# EAGLE design Large Digit Driver (EAGLE 7.2.0)
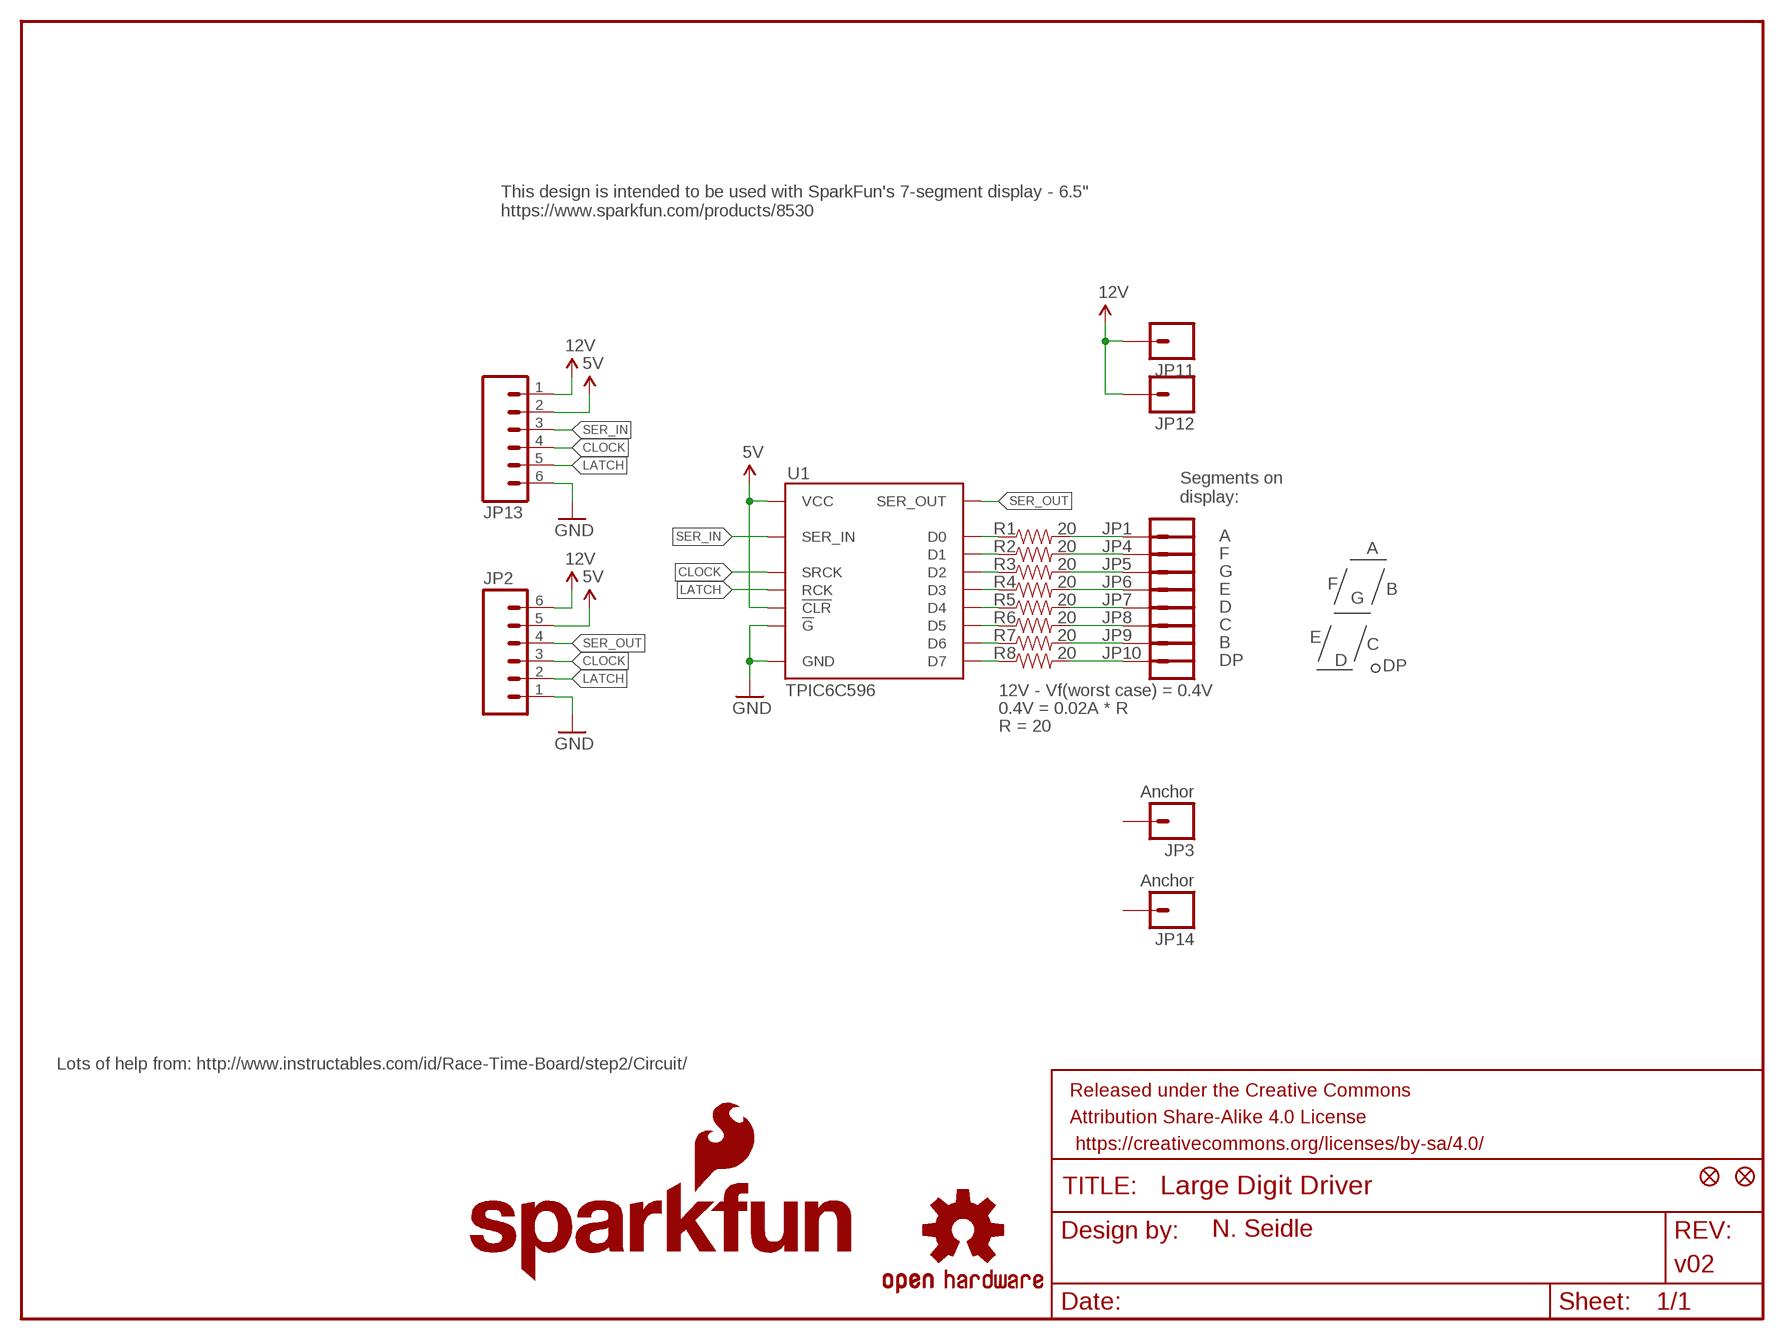
[diagram p0: schematic, sheet 1]

## Parts
FID1  FIDUCIAL1X2  [FIDUCIAL-1X2]
FID2  FIDUCIAL1X2  [FIDUCIAL-1X2]
FRAME1  FRAME-LETTER  [CREATIVE_COMMONS]
JP1  M01PTH_LONGPAD  [1X01_LONGPAD]
JP2  M06SMD  [1X06-SMD]
JP3  Anchor  M01PTH_LONGPAD  [1X01_LONGPAD]
JP4  M01PTH_LONGPAD  [1X01_LONGPAD]
JP5  M01PTH_LONGPAD  [1X01_LONGPAD]
JP6  M01PTH_LONGPAD  [1X01_LONGPAD]
JP7  M01PTH_LONGPAD  [1X01_LONGPAD]
JP8  M01PTH_LONGPAD  [1X01_LONGPAD]
JP9  M01PTH_LONGPAD  [1X01_LONGPAD]
JP10  M01PTH_LONGPAD  [1X01_LONGPAD]
JP11  M01PTH_LONGPAD  [1X01_LONGPAD]
JP12  M01PTH_LONGPAD  [1X01_LONGPAD]
JP13  M06SMD  [1X06-SMD]
JP14  Anchor  M01PTH_LONGPAD  [1X01_LONGPAD]
LOGO1  SFE_LOGO_NAME_FLAME.1_INCH  [SFE_LOGO_NAME_FLAME_.1]
LOGO2  OSHW-LOGOS  [OSHW-LOGO-S]
R1  20  20OHM1/10W1%(0603)SMD  [0603-RES]
R2  20  20OHM1/10W1%(0603)SMD  [0603-RES]
R3  20  20OHM1/10W1%(0603)SMD  [0603-RES]
R4  20  20OHM1/10W1%(0603)SMD  [0603-RES]
R5  20  20OHM1/10W1%(0603)SMD  [0603-RES]
R6  20  20OHM1/10W1%(0603)SMD  [0603-RES]
R7  20  20OHM1/10W1%(0603)SMD  [0603-RES]
R8  20  20OHM1/10W1%(0603)SMD  [0603-RES]
U1  TPIC6C596  TPIC6C596SOIC  [SO016]

## Nets
5V: JP2.5 JP13.2 U1.1(VCC) U1.7(!CLR)
12V: JP2.6 JP11.1 JP12.1 JP13.1
CLOCK: JP2.3 JP13.4 U1.15(SRCK)
D0: R1.1 U1.3(D0)
D1: R2.1 U1.4(D1)
D2: R3.1 U1.5(D2)
D3: R4.1 U1.6(D3)
D4: R5.1 U1.11(D4)
D5: R6.1 U1.12(D5)
D6: R7.1 U1.13(D6)
D7: R8.1 U1.14(D7)
GND: JP2.1 JP13.6 U1.8(!G) U1.16(GND)
LATCH: JP2.2 JP13.5 U1.10(RCK)
S0: JP1.1 R1.2
S1: JP4.1 R2.2
S2: JP5.1 R3.2
S3: JP6.1 R4.2
S4: JP7.1 R5.2
S5: JP8.1 R6.2
S6: JP9.1 R7.2
S7: JP10.1 R8.2
SER_IN: JP13.3 U1.2(SER_IN)
SER_OUT: JP2.4 U1.9(SER_OUT)
Unconnected: JP3.1 JP14.1

## Notes on the sheet
- This design is intended to be used with SparkFun's 7-segment display - 6.5"
  https://www.sparkfun.com/products/8530
- Segments on
  display:
- A
- A
- F
- G
- F
- E | B
- G
- D
- C
- E
- B | C
- DP | D
- DP
- 12V - Vf(worst case) = 0.4V
- 0.4V = 0.02A * R
- R = 20
- Lots of help from: http://www.instructables.com/id/Race-Time-Board/step2/Circuit/

## Library data of the parts
FID1 FID2 = SparkFun-Aesthetics:FIDUCIAL: Fiducial Alignment Points Various fiducial points for machine vision alignment.
FRAME1 = SparkFun-Aesthetics:FRAME-LETTER: Schematic Frame Standard 8.5x11 US Letter frame; DESIGNER: N. Seidle; VERSION: v02
JP1 JP3-JP12 JP14 = SparkFun-Connectors:M01: Header 1 Standard 1-pin 0.1" header. Use with straight break away headers (SKU : PRT-00116), right angle break away headers (PRT-00553), swiss pins (PRT-00743), machine pins (PRT-00117), and female headers (PRT-00115).
JP2 JP13 = SparkFun-Connectors:M06: Header 6 Standard 6-pin 0.1" header. Use with straight break away headers (SKU : PRT-00116), right angle break away headers (PRT-00553), swiss pins (PRT-00743), machine pins (PRT-00117), and female headers (PRT-00115). Molex polarized connector foot print use with SKU : PRT-08094 with associated crimp pins and housings. NOTES ON THE VARIANTS LOCK and LOCK_LONGPADS... This footprint was designed to help hold the alignment of a through-hole component (i.e. 6-pin header) while soldering it into place. You may notice that each hole has been shifted either up or down by 0.005 of an inch from it's more standard position (which is a perfectly straight line). This slight alteration caused the pins (the squares in the middle) to touch the edges of the holes. Because they are alternating, it causes a "brace" to hold the component in place. 0.005 has proven to be the perfect amount of "off-center" position when using our standard breakaway headers. Although looks a little odd when you look at the bare footprint, once you have a header in there, the alteration is very hard to notice. Also,if you push a header all the way into place, it is covered up entirely on the bottom side. This idea of altering the position of holes to aid alignment will be further integrated into the Sparkfun Library for other footprints. It can help hold any component with 3 or more connection pins.; PROD_ID: CONN-08971; VALUE: RA 6Pin SMD
LOGO1 = SparkFun-Aesthetics:SFE_LOGO_NAME_FLAME: SFE Logo, name and flame This is the SparkFun full logo. The logo on the schematic will always be the same size; the package variant is the height of the flame part of the logo. Default layer for the logo on the board is tSilk.
LOGO2 = SparkFun-Aesthetics:OSHW-LOGO: Open Source Hardware Logo This logo indicates the piece of hardware it is found on incorporates a OSHW license and/or adheres to the definition of open source hardware found here: http://freedomdefined.org/OSHW
R1-R8 = SparkFun-Resistors:20OHM1/10W1%(0603): RES-07862; PROD_ID: RES-07862
U1 = SparkFun-DigitalIC:TPIC6C596: SMD version of the popular sink driver. This version can sink up to 100mA per channel; PROD_ID: IC-12522

## Net classes
1 power: width 0.203 mm

## Board
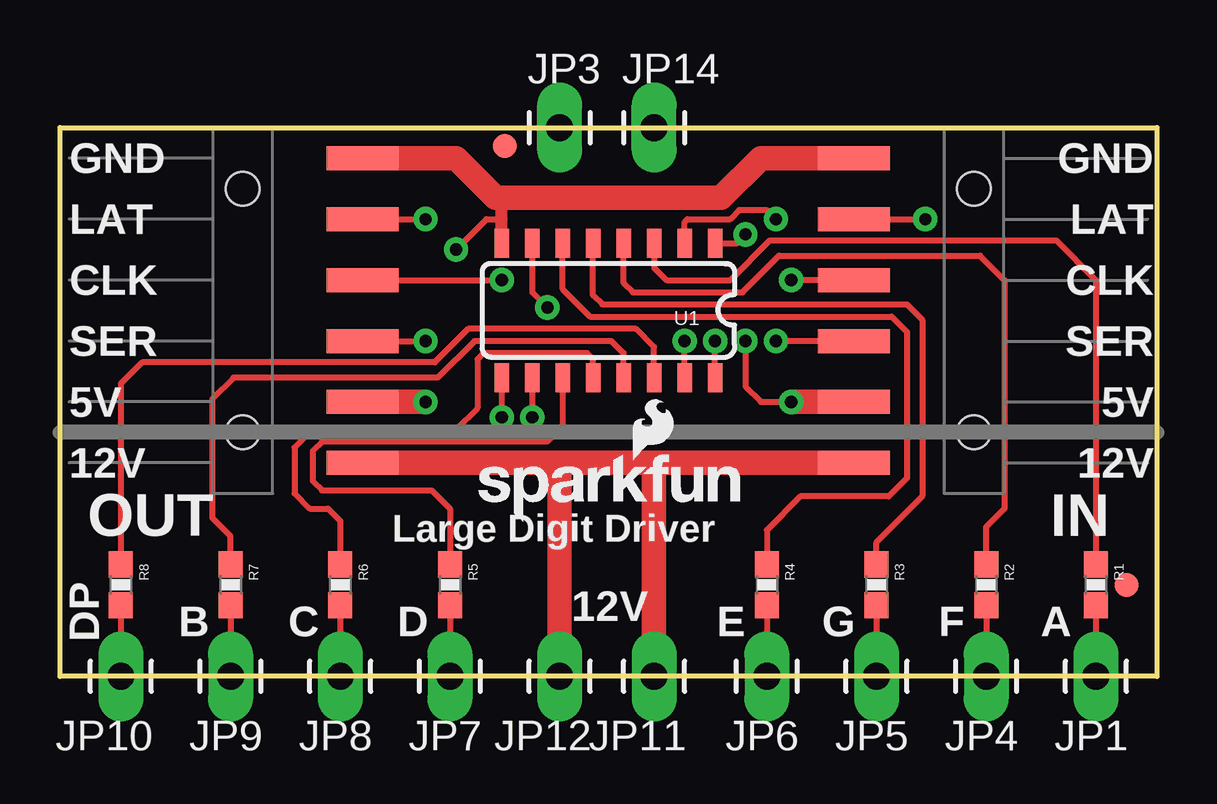
[diagram p1: board, top side]
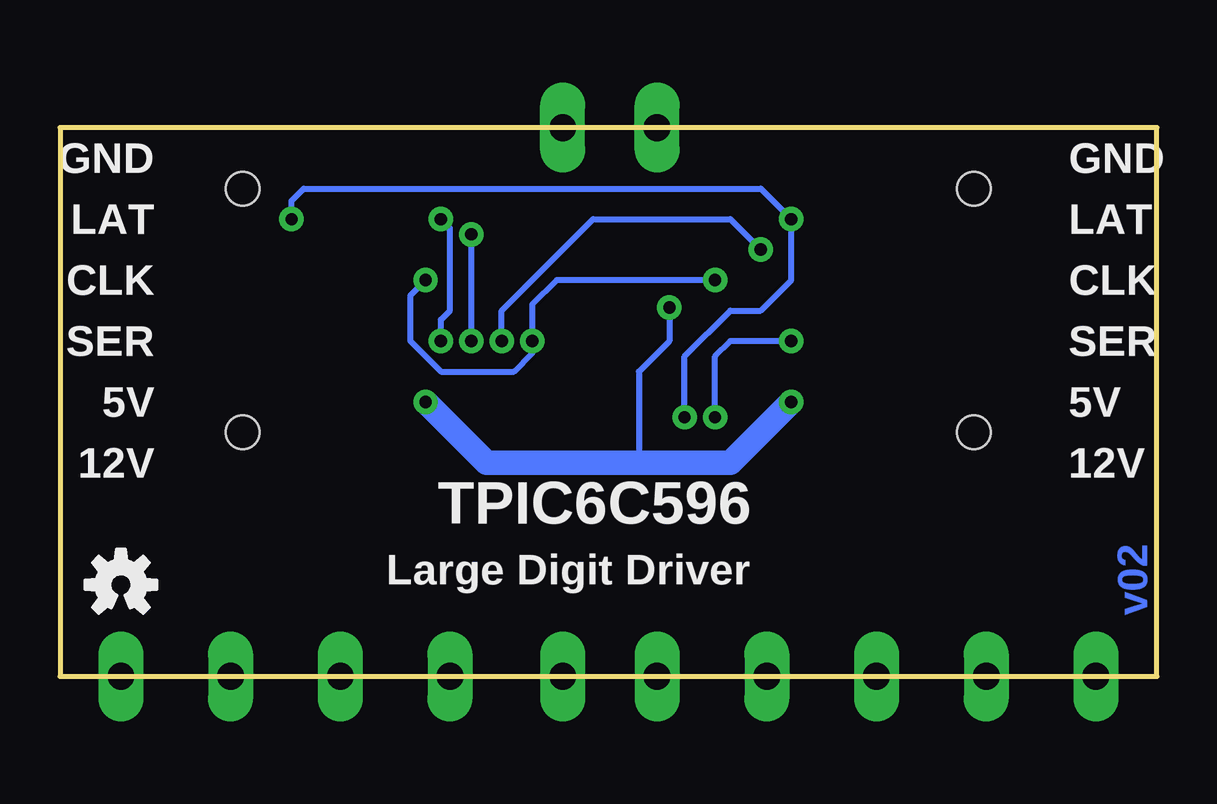
[diagram p2: board, bottom side, seen from below]

Size 45.72 x 22.86 mm. Coordinates in mm from the lower left corner, seen from the top.
Outline: 0,22.86 45.72,22.86 45.72,0 0,0 0,22.86
Copper layers (1*16): Top 0.035mm / dielectric 1.5mm / Bottom 0.035mm
Design rules "SparkFun-2-layer": minimum track width 7mil, minimum drill 15mil, track to track 8mil, track to pad 8mil, pad to pad 8mil, via to via 8mil, smd to smd 8mil, copper to edge 8mil, drill to drill 8mil, minimum pad ring 12mil, minimum via ring 10mil, stop-mask expansion 4mil, vias tented up to drill 20mil, thermal gap 10mil

### Footprints (pad centres in the part's own frame; a part is rotated, then mirrored left to right if it is on the bottom)
FIDUCIAL-1X2 = smd 1 x 1: 1 0,0
1X01_LONGPAD = drill 1.118 pad 1.88 long: 1 0,0
1X06-SMD = smd 1 x 3: 1 -6.35,5; 2 -3.81,5; 3 -1.27,5; 4 1.27,5; 5 3.81,5; 6 6.35,5 | hole 1.4: -5.08,0; 5.08,0
0603-RES = smd 1.1 x 1: 1 -0.85,0; 2 0.85,0
SO016 = smd 0.6 x 1.2: 1 -4.445,-2.8; 2 -3.175,-2.8; 3 -1.905,-2.8; 4 -0.635,-2.8; 5 0.635,-2.8; 6 1.905,-2.8; 7 3.175,-2.8; 8 4.445,-2.8; 9 4.445,2.8; 10 3.175,2.8; 11 1.905,2.8; 12 0.635,2.8; 13 -0.635,2.8; 14 -1.905,2.8; 15 -3.175,2.8; 16 -4.445,2.8

### Placement (x,y rotation side)
FID1  18.54,22.1 0 top
FID2  44.45,3.81 0 top
FRAME1  -6.35,-17.78 0 top  (outside the outline)
JP1  43.18,0 180 top
JP2  7.62,15.24 270 top
JP3  20.83,22.86 0 top
JP4  38.61,0 180 top
JP5  34.04,0 180 top
JP6  29.46,0 180 top
JP7  16.26,0 180 top
JP8  11.68,0 180 top
JP9  7.11,0 180 top
JP10  2.54,0 180 top
JP11  24.77,0 180 top
JP12  20.83,0 180 top
JP13  38.1,15.24 90 top
JP14  24.77,22.86 0 top
LOGO1  17.02,6.35 0 top
LOGO2  43.18,3.81 0 bottom
R1  43.18,3.81 270 top
R2  38.61,3.81 270 top
R3  34.04,3.81 270 top
R4  29.46,3.81 270 top
R5  16.26,3.81 270 top
R6  11.68,3.81 270 top
R7  7.11,3.81 270 top
R8  2.54,3.81 270 top
U1  22.86,15.24 180 top

### Tracks (layer width: path | path; a pad name or v marks a point on that pad's centre or on a via)
5V  (via drill 0.51)
  Top 0.254: v20.32,15.37 19.68,16 U1.7 | v28.57,13.97 28.57,12.06 29.21,11.43 v30.48,11.43 | U1.1 28.2,18.04 v28.57,18.41
  Top 1.016: JP2.5 v15.24,11.43 | JP13.2 v30.48,11.43
  Bottom 0.254: v20.32,15.37 20.32,13.97 21.59,12.7 21.59,8.89 | v28.57,18.41 v28.57,13.97
  Bottom 1.016: v30.48,11.43 27.94,8.89 21.59,8.89 17.78,8.89 v15.24,11.43
12V
  Top 0.254: 20.83,8.76 20.7,8.89
  Top 1.016: JP13.1 24.77,8.89 | 24.77,8.89 20.7,8.89 JP2.6 | JP12.1 20.83,8.76 | JP11.1 24.77,8.89
CLOCK  (via drill 0.51)
  Top 0.254: JP2.3 v18.41,16.51 | JP13.4 v30.48,16.51 | U1.15 v26.04,13.97
  Bottom 0.254: v18.41,16.51 25.02,16.51 26.04,15.49 v26.04,13.97 26.04,13.46 26.8,12.7 29.84,12.7 31.11,13.97 31.11,15.88 v30.48,16.51
D0
  Top 0.254: R1.1 43.18,16.51 41.53,18.16 29.59,18.16 27.94,16.51 25.27,16.51 24.77,17.02 U1.3
D1
  Top 0.254: R2.1 38.61,6.22 39.37,6.99 39.37,16.51 38.35,17.53 29.97,17.53 28.45,16 23.88,16 23.5,16.38 U1.4
D2
  Top 0.254: R3.1 34.04,5.59 35.94,7.49 35.94,14.86 35.31,15.49 22.61,15.49 22.23,15.88 U1.5
D3
  Top 0.254: R4.1 29.46,6.1 30.86,7.49 34.54,7.49 35.31,8.26 35.31,14.35 34.67,14.99 22.1,14.99 20.95,16.13 U1.6
D4
  Top 0.254: R5.1 16.26,6.99 15.49,7.75 10.92,7.75 10.54,8.13 10.54,9.4 10.92,9.78 20.32,9.78 20.95,10.41 U1.11
D5
  Top 0.254: R6.1 11.68,6.48 11.18,6.99 10.41,6.99 9.78,7.62 9.78,9.53 10.54,10.29 16.51,10.29 17.4,11.18 17.4,13.21 17.65,13.46 21.97,13.46 22.23,13.21 U1.12
D6
  Top 0.254: R7.1 7.11,5.84 6.35,6.6 6.35,11.56 7.24,12.45 15.75,12.45 17.27,13.97 22.99,13.97 23.5,13.46 U1.13
D7
  Top 0.254: R8.1 2.54,12.19 3.43,13.08 15.62,13.08 17.02,14.48 24,14.48 24.77,13.72 U1.14
GND  (via drill 0.51)
  Top 0.254: U1.16 v27.3,13.97 | v16.51,17.78 17.78,19.05 18.41,19.05
  Top 0.508: U1.8 18.41,19.05 18.41,19.81 18.29,19.94
  Top 1.016: JP13.6 29.21,21.59 27.56,19.94 18.29,19.94 18.16,19.94 16.51,21.59 JP2.1
  Bottom 0.254: v27.3,13.97 27.3,15.24 23.5,19.05 17.78,19.05 v16.51,17.78
LATCH  (via drill 0.51)
  Top 0.254: JP2.2 v15.24,19.05 | U1.10 v19.68,10.79 | JP13.5 v36.07,19.05
  Bottom 0.254: v19.68,10.79 19.68,13.34 17.78,15.24 16.51,15.24 15.24,16.51 v15.24,19.05 16.51,20.32 35.56,20.32 36.07,19.81 v36.07,19.05
S0
  Top 0.254: R1.2 JP1.1
S1
  Top 0.254: R2.2 JP4.1
S2
  Top 0.254: R3.2 JP5.1
S3
  Top 0.254: R4.2 JP6.1
S4
  Top 0.254: R5.2 JP7.1
S5
  Top 0.254: R6.2 JP8.1
S6
  Top 0.254: R7.2 JP9.1
S7
  Top 0.254: R8.2 JP10.1
SER_IN  (via drill 0.51)
  Top 0.254: JP13.3 v29.84,13.97 | U1.2 26.04,18.92 26.16,19.05 27.94,19.05 28.32,19.43 29.46,19.43 v29.84,19.05
  Bottom 0.254: v29.84,13.97 29.84,14.86 29.46,15.24 29.46,18.67 v29.84,19.05
SER_OUT  (via drill 0.51)
  Top 0.254: JP2.4 v15.24,13.97 | U1.9 v18.41,10.79
  Bottom 0.254: v18.41,10.79 18.41,13.34 17.78,13.97 v15.24,13.97

### Text on the board
Dimension: Leave room on panel for these castelated holes to be milled.
tPlace: GND | GND | LAT | LAT | CLK | CLK | SER | SER | 5V | 5V | 12V | 12V | OUT | Large Digit Driver | IN | DP | 12V | B | C | D | E | G | F | A
bPlace: GND | GND | LAT | LAT | CLK | CLK | SER | SER | 5V | 5V | 12V | 12V | TPIC6C596 | Large Digit Driver